# Altium schematic sheet REACTION-CIRCUIT.SchDoc
size A4
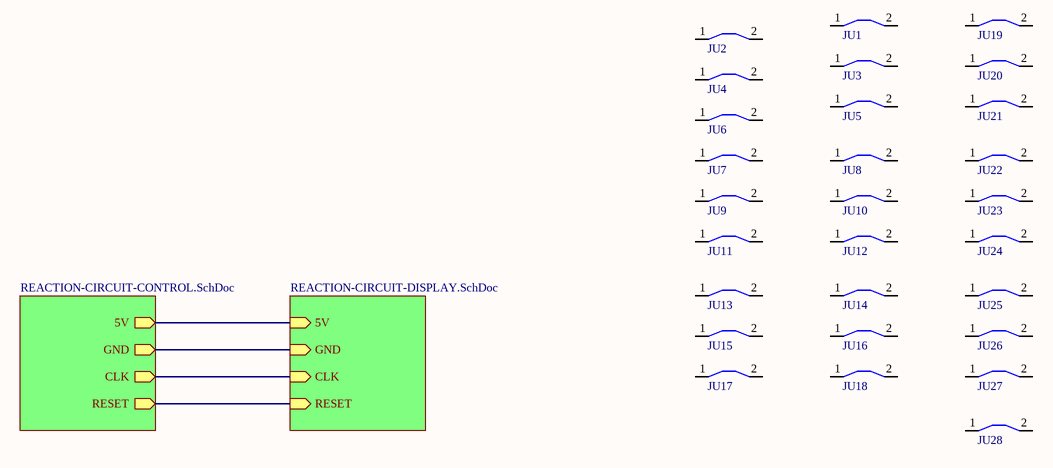
[diagram p0: REACTION-CIRCUIT.SchDoc]

## Parts
JU1  JUMPER 5MM  [JUMPER 10MM]  (value not drawn)
JU2  JUMPER 5MM  [JUMPER 10MM]  (value not drawn)
JU3  JUMPER 5MM  [JUMPER 10MM]  (value not drawn)
JU4  JUMPER 5MM  [JUMPER 10MM]  (value not drawn)
JU5  JUMPER 5MM  [JUMPER 5MM]  (value not drawn)
JU6  JUMPER 5MM  [JUMPER 5MM]  (value not drawn)
JU7  JUMPER 5MM  [JUMPER 5MM]  (value not drawn)
JU8  JUMPER 5MM  [JUMPER 5MM]  (value not drawn)
JU9  JUMPER 5MM  [JUMPER 5MM]  (value not drawn)
JU10  JUMPER 5MM  [JUMPER 5MM]  (value not drawn)
JU11  JUMPER 5MM  [JUMPER 5MM]  (value not drawn)
JU12  JUMPER 5MM  [JUMPER 5MM]  (value not drawn)
JU13  JUMPER 5MM  [JUMPER 5MM]  (value not drawn)
JU14  JUMPER 5MM  [JUMPER 5MM]  (value not drawn)
JU15  JUMPER 5MM  [JUMPER 5MM]  (value not drawn)
JU16  JUMPER 5MM  [JUMPER 5MM]  (value not drawn)
JU17  JUMPER 5MM  [JUMPER 5MM]  (value not drawn)
JU18  JUMPER 5MM  [JUMPER 5MM]  (value not drawn)
JU19  JUMPER 5MM  [JUMPER 5MM]  (value not drawn)
JU20  JUMPER 5MM  [JUMPER 5MM]  (value not drawn)
JU21  JUMPER 5MM  [JUMPER 5MM]  (value not drawn)
JU22  JUMPER 5MM  [JUMPER 5MM]  (value not drawn)
JU23  JUMPER 5MM  [JUMPER 5MM]  (value not drawn)
JU24  JUMPER 5MM  [JUMPER 5MM]  (value not drawn)
JU25  JUMPER 5MM  [JUMPER 5MM]  (value not drawn)
JU26  JUMPER 5MM  [JUMPER 5MM]  (value not drawn)
JU27  JUMPER 5MM  [JUMPER 5MM]  (value not drawn)
JU28  JUMPER 5MM  [JUMPER 5MM]  (value not drawn)

## Sub-sheets
REACTION-CIRCUIT-CONTROL.SchDoc = REACTION-CIRCUIT-CONTROL.SchDoc: 5V (out), GND (out), CLK (out), RESET (out)
REACTION-CIRCUIT-DISPLAY.SchDoc = REACTION-CIRCUIT-DISPLAY.SchDoc: 5V (in), GND (in), CLK (in), RESET (in)

## Nets
(unnamed): sheet REACTION-CIRCUIT-CONTROL.SchDoc/5V, sheet REACTION-CIRCUIT-DISPLAY.SchDoc/5V
(unnamed): sheet REACTION-CIRCUIT-CONTROL.SchDoc/GND, sheet REACTION-CIRCUIT-DISPLAY.SchDoc/GND
(unnamed): sheet REACTION-CIRCUIT-CONTROL.SchDoc/CLK, sheet REACTION-CIRCUIT-DISPLAY.SchDoc/CLK
(unnamed): sheet REACTION-CIRCUIT-CONTROL.SchDoc/RESET, sheet REACTION-CIRCUIT-DISPLAY.SchDoc/RESET

Not connected (* = marked no-connect by the designer): JU1 1 2; JU2 1 2; JU3 1 2; JU4 1 2; JU5 1 2; JU6 1 2; JU7 1 2; JU8 1 2; JU9 1 2; JU10 1 2; JU11 1 2; JU12 1 2; JU13 1 2; JU14 1 2; JU15 1 2; JU16 1 2; JU17 1 2; JU18 1 2; JU19 1 2; JU20 1 2; JU21 1 2; JU22 1 2; JU23 1 2; JU24 1 2; JU25 1 2; JU26 1 2; JU27 1 2; JU28 1 2